# EAGLE design side_panel (EAGLE 6.6.0)
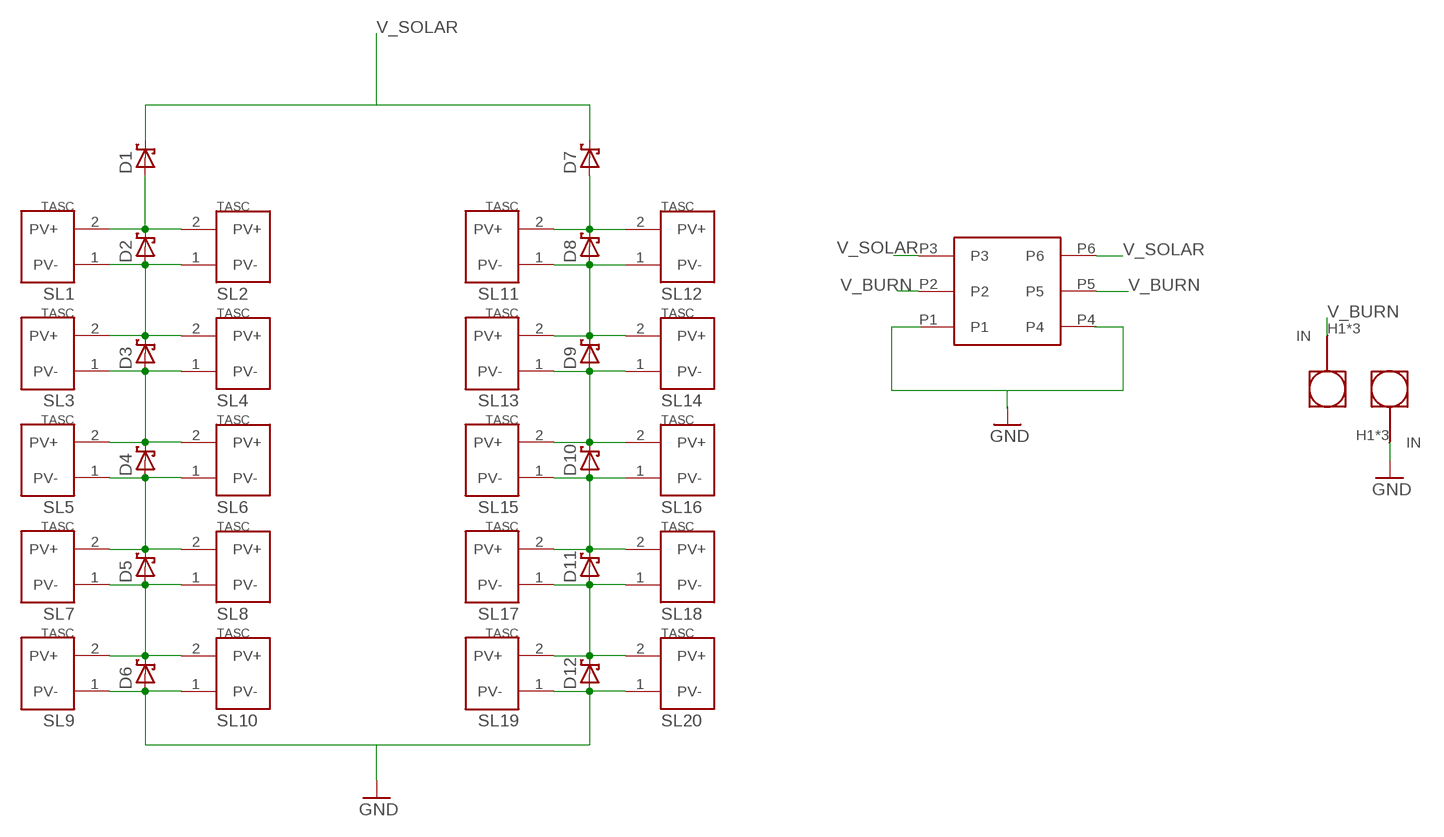
[diagram p0: schematic, sheet 1]

## Parts
D1  SB_DIODE  [SB_DIODE]
D2  SB_DIODE  [SB_DIODE]
D3  SB_DIODE  [SB_DIODE]
D4  SB_DIODE  [SB_DIODE]
D5  SB_DIODE  [SB_DIODE]
D6  SB_DIODE  [SB_DIODE]
D7  SB_DIODE  [SB_DIODE]
D8  SB_DIODE  [SB_DIODE]
D9  SB_DIODE  [SB_DIODE]
D10  SB_DIODE  [SB_DIODE]
D11  SB_DIODE  [SB_DIODE]
D12  SB_DIODE  [SB_DIODE]
SL1  SOLAR_CELL  [SOLAR_CELL]
SL2  SOLAR_CELL  [SOLAR_CELL]
SL3  SOLAR_CELL  [SOLAR_CELL]
SL4  SOLAR_CELL  [SOLAR_CELL]
SL5  SOLAR_CELL  [SOLAR_CELL]
SL6  SOLAR_CELL  [SOLAR_CELL]
SL7  SOLAR_CELL  [SOLAR_CELL]
SL8  SOLAR_CELL  [SOLAR_CELL]
SL9  SOLAR_CELL  [SOLAR_CELL]
SL10  SOLAR_CELL  [SOLAR_CELL]
SL11  SOLAR_CELL  [SOLAR_CELL]
SL12  SOLAR_CELL  [SOLAR_CELL]
SL13  SOLAR_CELL  [SOLAR_CELL]
SL14  SOLAR_CELL  [SOLAR_CELL]
SL15  SOLAR_CELL  [SOLAR_CELL]
SL16  SOLAR_CELL  [SOLAR_CELL]
SL17  SOLAR_CELL  [SOLAR_CELL]
SL18  SOLAR_CELL  [SOLAR_CELL]
SL19  SOLAR_CELL  [SOLAR_CELL]
SL20  SOLAR_CELL  [SOLAR_CELL]
U$1  G125-FV20605L0P  [G125-FV20605L0P]
U$2  BURNER  [BURNER]
U$4  BURNER  [BURNER]

## Nets
GND: D6.POS D12.POS SL9.1(PV-) SL10.1(PV-) SL19.1(PV-) SL20.1(PV-) U$2.H1(IN) U$2.H2(IN) U$2.H3(IN)
N$2: D8.POS D9.NEG SL11.1(PV-) SL12.1(PV-) SL13.2(PV+) SL14.2(PV+)
N$3: D9.POS D10.NEG SL13.1(PV-) SL14.1(PV-) SL15.2(PV+) SL16.2(PV+)
N$4: D10.POS D11.NEG SL15.1(PV-) SL16.1(PV-) SL17.2(PV+) SL18.2(PV+)
N$6: D11.POS D12.NEG SL17.1(PV-) SL18.1(PV-) SL19.2(PV+) SL20.2(PV+)
N$8: D7.POS D8.NEG SL11.2(PV+) SL12.2(PV+)
N$9: D1.POS D2.NEG SL1.2(PV+) SL2.2(PV+)
N$37: D3.POS D4.NEG SL3.1(PV-) SL4.1(PV-) SL5.2(PV+) SL6.2(PV+)
N$39: D4.POS D5.NEG SL5.1(PV-) SL6.1(PV-) SL7.2(PV+) SL8.2(PV+)
N$45: D2.POS D3.NEG SL1.1(PV-) SL2.1(PV-) SL3.2(PV+) SL4.2(PV+)
N$50: D5.POS D6.NEG SL7.1(PV-) SL8.1(PV-) SL9.2(PV+) SL10.2(PV+)
V_BURN: U$1.P2 U$1.P5 U$4.H1(IN) U$4.H2(IN) U$4.H3(IN)
V_SOLAR: D1.NEG D7.NEG U$1.P3 U$1.P6
Unconnected: U$1.P1 U$1.P4

## Library data of the parts
D1-D12 = phonesat:SB_DIODE
SL1-SL20 = phonesat:SOLAR_CELL
U$1 = G125-FV20605L0P:G125-FV20605L0P: Harwin Gecko female connector, 2x3
U$2 U$4 = Burner:BURNER

## Board
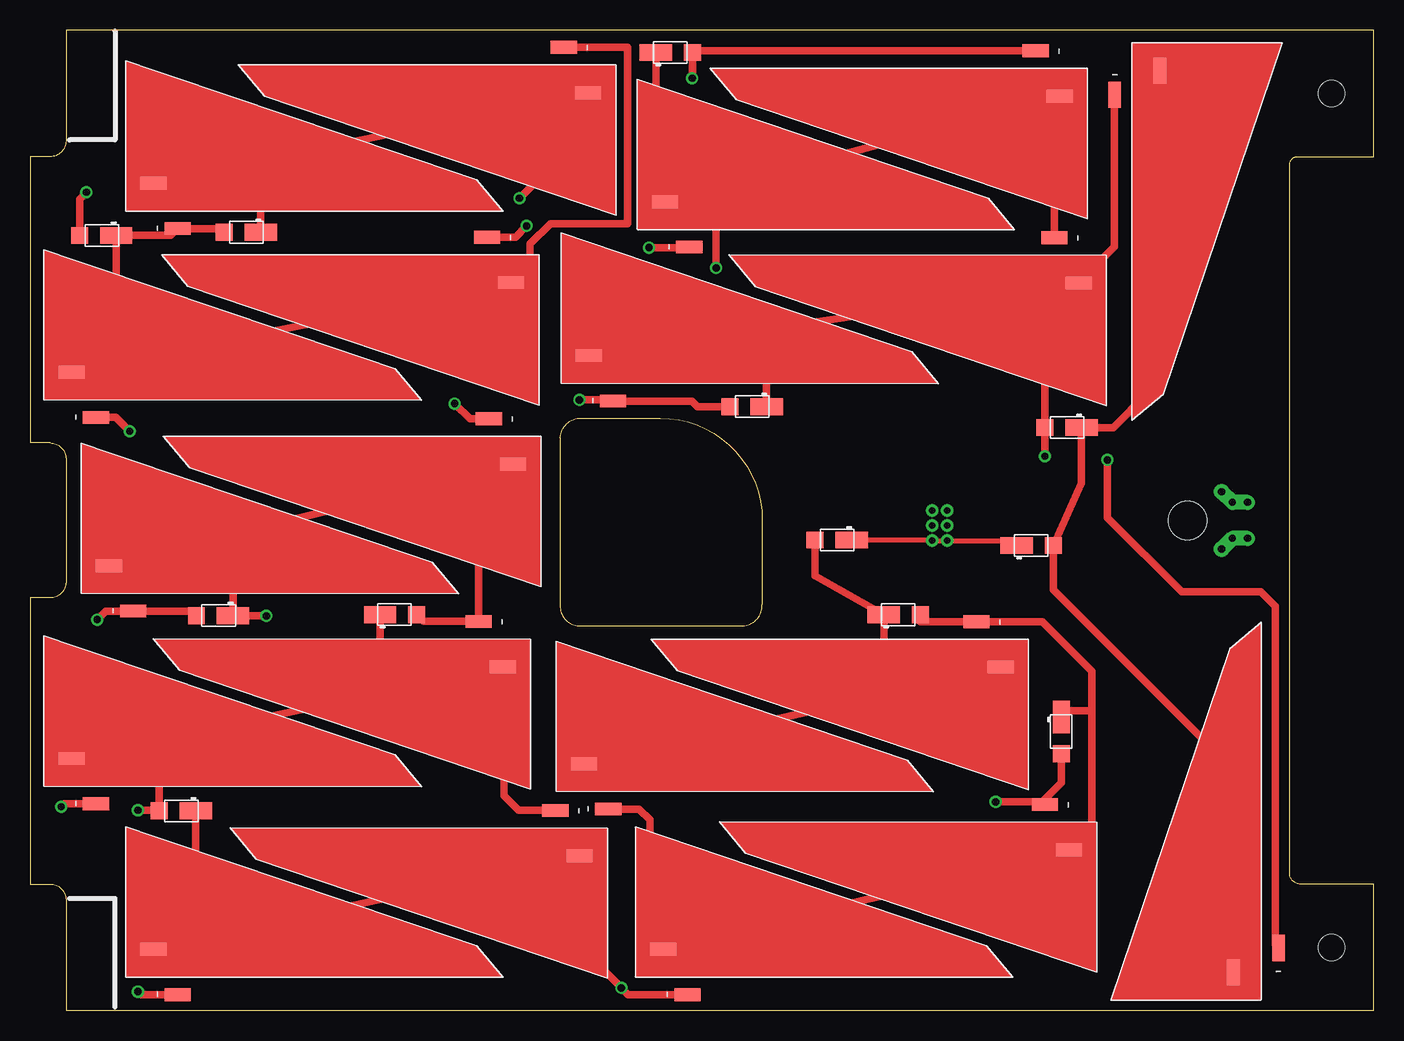
[diagram p1: board, top side]
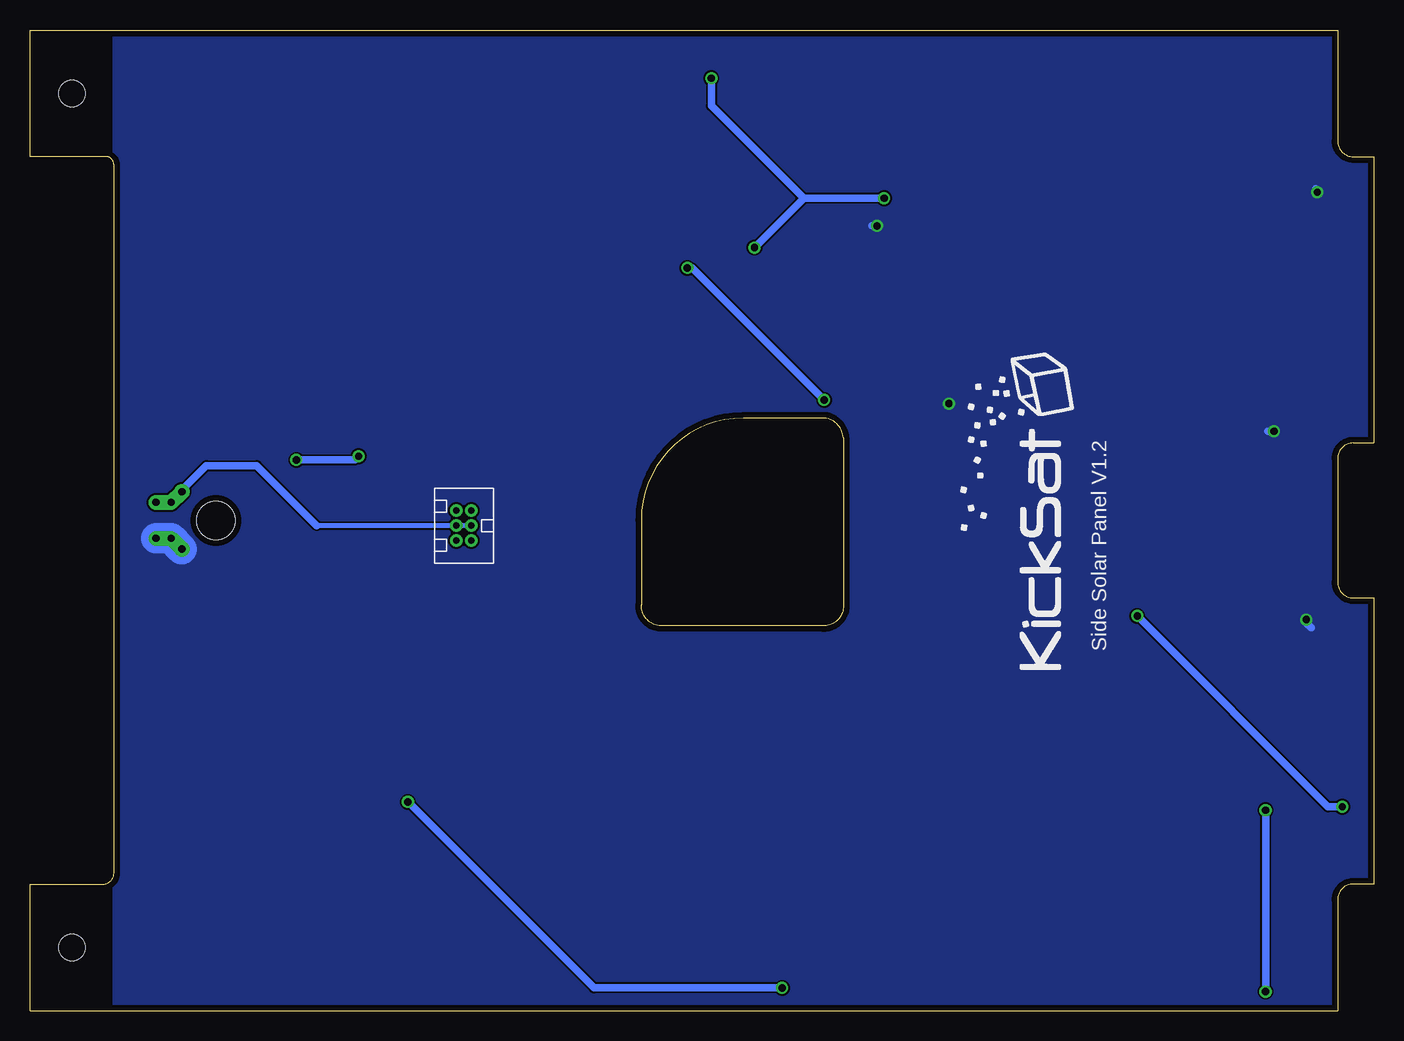
[diagram p2: board, bottom side, seen from below]

Size 112 x 81.73 mm. Coordinates in mm from the lower left corner, seen from the top.
Outline: 112,0 3,0 3,9.25 arc90 1.7,10.55 0,10.55 0,34.41 1.7,34.41 arc90 3,35.72 3,46.02 arc90 1.7,47.31 0,47.31 0,71.18 1.7,71.18 arc90 3,72.48 3,81.73 112,81.73 112,71.18 105.68,71.18 arc90 105,70.49 105,11.46 arc90 105.9,10.55 112,10.55 112,0
Outline: 52.54,49.39 arc-90 61.04,40.89 61.04,33.82 arc-90 59.42,32.09 45.91,32.08 arc-90 44.2,33.63 44.2,47.77 arc-90 46.08,49.39 52.54,49.39
Copper layers (1*16): Top 0.0178mm / dielectric 59mil / Bottom 0.0178mm
Design rules "SSC-EAGLE-2Lyr_v1.0.0.3": minimum track width 6mil, minimum drill 14mil, track to track 6mil, track to pad 6mil, pad to pad 6mil, via to via 6mil, smd to smd 6mil, copper to edge 20mil, drill to drill 16mil, minimum pad ring 8mil, minimum via ring 8mil, stop-mask expansion 3mil, vias tented up to drill 0mil, thermal gap 10mil
Holes 2.2 mm at 108.5,76.45 108.5,5.28
Holes 3.2 mm at 96.5,40.87

### Footprints (pad centres in the part's own frame; a part is rotated, then mirrored left to right if it is on the bottom)
SB_DIODE = smd 2.7 x 1.4: NEG -1.2,0 | smd 1.4 x 1.4: POS 1.85,0
SOLAR_CELL = smd 1.067 x 2.184: 1 -1.589,2.999; 2 2.187,5.011
G125-FV20605L0P = drill 0.55 pad 1.05: P1 -1.25,3.085; P2 0,3.085; P3 1.25,3.085; P4 -1.25,1.835; P5 0,1.835; P6 1.25,1.835
BURNER = drill 0.6 pad 1.27 offset: H1 0,0; H2 1.27,0 | drill 0.6 pad 1.27: H3 2.159,0.889

### Placement (x,y rotation side)
D1  83.45,38.77 0 top
D2  86.45,48.6 180 top
D3  60.2,50.34 180 top
D4  53.38,79.86 0 top
D5  18.04,64.88 180 top
D6  5.99,64.61 180 top
D7  67.29,39.23 180 top
D8  72.38,33 0 top
D9  85.97,23.27 270 top
D10  12.62,16.66 180 top
D11  30.39,33.01 0 top
D12  15.73,32.93 180 top
SL1  92,73.33 0 top
SL2  102.5,8.23 180 top
SL3  82.4,62.84 270 top
SL4  51.6,52.41 90 top
SL5  80.83,78.4 270 top
SL6  57.95,65.23 90 top
SL7  41.5,78.7 270 top
SL8  15.3,66.77 90 top
SL9  35.1,62.87 270 top
SL10  8.5,51.03 90 top
SL11  75.9,30.83 270 top
SL12  51.2,18.4 90 top
SL13  81.6,15.6 270 top
SL14  57.8,2.93 90 top
SL15  40.8,15.1 270 top
SL16  15.3,2.93 90 top
SL17  34.4,30.85 270 top
SL18  8.5,18.83 90 top
SL19  35.25,47.74 270 top
SL20  11.6,34.9 90 top
U$1  78.28,40.43 270 bottom
U$2  101.5,39.37 180 top
U$4  101.5,42.37 0 bottom

### Tracks (layer width: path | path; a pad name or v marks a point on that pad's centre or on a via)
GND  (via drill 0.6)
  Top 0.61: SL10.1 7.16,49.44 v8.3,48.3 | SL19.1 36.67,49.33 v35.4,50.6 | SL9.1 40.46,64.46 v41.4,65.4 | D6.POS 4.14,67.64 v4.7,68.2 | D12.POS 13.5,33.31 SL20.1 6.31,33.31 v5.6,32.6
  Bottom 0.61: v8.3,48.3 8.8,48.3 | v35.4,50.6 35.4,50.7 35.3,50.8 | v41.4,65.4 41.8,65.4 | v4.7,68.2 4.7,68.4 4.8,68.5 | v5.6,32.6 5.6,32.3 5.2,31.9
  Bottom 2.54: U$2.H1 U$2.H2 U$2.H3
  pour Bottom: 0,81.73 0,0 105,0 105,81.73
  cutout Bottom: 44.2,47.83 44.2,33.73 arc90 45.8,32.13 59.4,32.13 arc90 61,33.73 61,40.93 arc90 52.6,49.33 45.7,49.33 arc90
N$2
  Top 0.61: SL14.2 53.55,5.3 | 53.55,5.3 SL13.2 87.8,14.6 88.4,14.6 88.5,14.7 88.5,25 | SL12.1 50.79,16.81 51.7,15.9 51.7,7.15 53.55,5.3 | D8.POS 74.23,32.42 SL11.1 84.38,32.42 88.5,28.3 88.5,25 | D9.NEG 86.5,25 88.5,25
N$3  (via drill 0.6)
  Top 0.61: D10.NEG 13.82,5.12 SL16.2 SL15.2 47.5,11.22 47.5,3.7 v49.3,1.9 49.86,1.34 SL14.1 | v80.5,17.4 84.39,17.4 | 84.39,17.4 SL13.1 | 84.39,17.4 85.97,18.98 D9.POS
  Bottom 0.61: v49.3,1.9 65,1.9 v80.5,17.4
N$4  (via drill 0.6)
  Top 0.61: SL17.2 SL18.2 10.77,21.02 D10.POS 10.73,16.7 v9,16.7 | SL17.2 29.19,28.66 D11.NEG | SL17.2 39.41,21.08 39.5,20.99 39.5,17.9 40.71,16.69 SL15.1 | SL16.1 9.26,1.34 v9,1.6
  Bottom 0.61: v9,1.6 v9,16.7
N$6  (via drill 0.6)
  Top 0.61: D11.POS 32.81,32.44 SL17.1 37.4,45.55 SL19.2 SL20.2 16.93,37.09 D12.NEG 16.96,32.9 v19.7,32.9 | SL18.1 2.84,17.24 v2.6,17
  Bottom 0.61: v2.6,17 3.8,17 v19.7,32.9
N$8
  Top 0.61: SL12.2 SL11.2 71.18,28.64 D8.NEG 65.45,36.24 D7.POS
N$9
  Top 0.61: SL1.2 93.1,77.25 93.1,51.4 90.3,48.6 D2.NEG 87.65,43.96 D1.POS 85.31,35.09 100.3,20.1 100.3,4.8 100.1,4.6 100.1,3.43 SL2.2
N$37  (via drill 0.6)
  Top 0.61: 53.45,67.55 SL6.2 57.2,67.42 v57.2,61.9 | 53.45,67.55 SL5.2 85.4,76.21 SL3.1 85.84,64.43 | D4.NEG 52.18,68.82 53.45,67.55 | v45.8,50.9 48.52,50.9 SL4.1 48.62,50.8 55.2,50.8 55.66,50.34 D3.POS
  Bottom 0.61: v57.2,61.9 56.8,61.9 v45.8,50.9
N$39  (via drill 0.6)
  Top 0.61: D5.NEG 19.24,68.96 SL8.2 SL7.2 46.51,73.41 v40.8,67.7 | v51.6,63.6 54.91,63.6 SL6.1 | v55.2,77.7 55.23,77.7 D4.POS 55.36,79.99 SL5.1
  Bottom 0.61: v40.8,67.7 47.5,67.7 | 47.5,67.7 v51.6,63.6 | v55.2,77.7 55.2,75.4 47.5,67.7
N$45  (via drill 0.6)
  Top 0.61: SL3.2 SL4.2 61.4,54.6 D3.NEG | SL1.1 90.41,63.65 SL3.2 | SL3.2 84.6,57.84 D2.POS v84.6,46.2 | SL2.1 103.8,5.52 103.8,33.7 102.6,34.9 96,34.9 89.8,41.1 v89.8,45.9
  Bottom 0.61: v89.8,45.9 84.9,45.9 v84.6,46.2
N$50
  Top 0.61: D5.POS 15.89,65.18 SL8.1 11.73,64.61 D6.NEG 7.19,60.91 3.49,60.91 SL10.2 SL9.2 41.7,62.27 41.7,63.9 43.4,65.6 49.8,65.6 49.8,80.29 SL7.1
V_BURN
  Bottom 0.406: U$4.H3 99.34,43.39 | U$1.P2 U$1.P5 88.1,40.43
  Bottom 0.61: U$4.H3 U$4.H2 U$4.H1 | 99.34,43.39 97.3,45.43 93.1,45.43 88.1,40.43
V_SOLAR
  Top 0.406: 69.09,39.24 75.2,39.24 U$1.P3 U$1.P6 82.25,39.18 D1.NEG
  Top 0.61: 69.09,39.24 D7.NEG | 81.97,38.88 D1.NEG

### Text on the board
bPlace: Side Solar Panel V1.2